# EAGLE design light sensor microshield v3 (EAGLE 6.4)
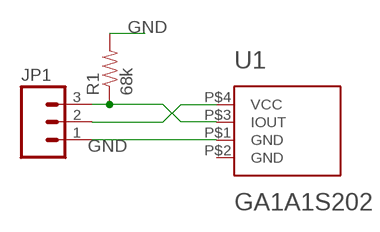
[diagram p0: schematic, sheet 1]

## Parts
JP1  M03PTH  [1X03]
R1  68k  RESISTOR0603-RES  [0603-RES]
U1  GA1A1S202  [GA1A12S202]

## Nets
GND: JP1.1 R1.2 U1.P$1(GND)
N$2: JP1.2 U1.P$4(VCC)
N$3: JP1.3 R1.1 U1.P$3(IOUT)

## Power pins joined to a net without a drawn wire
GND: U1.P$2(GND)

## Library data of the parts
JP1 = SparkFun-Connectors:M03: Header 3 Standard 3-pin 0.1" header. Use with straight break away headers (SKU : PRT-00116), right angle break away headers (PRT-00553), swiss pins (PRT-00743), machine pins (PRT-00117), and female headers (PRT-00115). Molex polarized connector foot print use with SKU : PRT-08232 with associated crimp pins and housings.
R1 = my library:RESISTOR: Resistor Basic schematic elements and footprints for 0603, 1206, and PTH resistors.
U1 = my library:GA1A1S202: GA1A1S202WP - Analog Light Sensor Technical Specifications: VCC: 2.3-3.2V Operating Temperature: -40°C to 85°C Dynamic Range: 3-55000 lux Peak Sensitivty: 555 nm Digikey: 425-2789-1-ND Mouser: 852-GA1A1S202WP

## Board
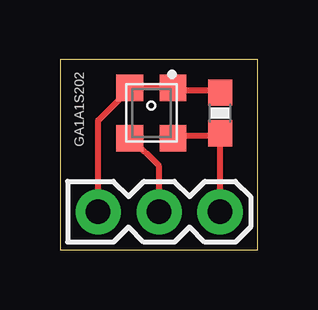
[diagram p1: board, top side]
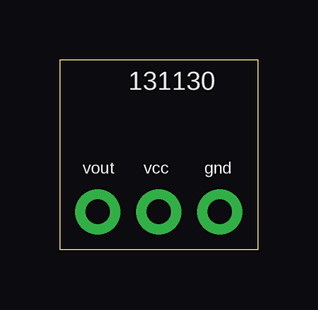
[diagram p2: board, bottom side, seen from below]

Size 8.24 x 7.93 mm. Coordinates in mm from the lower left corner, seen from the top.
Outline: 0,0 8.24,0 8.24,7.93 0,7.93 0,0
Copper layers (1*16): Top 0.0356mm / dielectric 1.5011mm / Bottom 0.0356mm
Design rules "LaenPCBOrder2 *": minimum track width 6mil, minimum drill 13mil, track to track 6mil, track to pad 6mil, pad to pad 6mil, via to via 6mil, smd to smd 6mil, copper to edge 15mil, drill to drill 6mil, minimum pad ring 7mil, minimum via ring 7mil, stop-mask expansion 4mil, vias tented up to drill 0mil, thermal gap 10mil

### Footprints (pad centres in the part's own frame; a part is rotated, then mirrored left to right if it is on the bottom)
1X03 = drill 1.016 pad 1.88: 1 0,0; 2 2.54,0; 3 5.08,0
0603-RES = smd 1.1 x 1: 1 -0.85,0; 2 0.85,0
GA1A12S202 = smd 1.108 x 1.108: P$1 -1.054,-0.904; P$2 -1.054,0.904; P$3 1.054,0.904; P$4 1.054,-0.904

### Placement (x,y rotation side)
JP1  1.59,1.59 0 top
R1  6.67,5.71 90 top
U1  3.81,5.71 270 top

### Tracks (layer width: path | path; a pad name or v marks a point on that pad's centre or on a via)
GND
  Top 0.254: R1.2 6.67,6.67 4.76,6.67 U1.P$2 4.64,6.79 2.98,6.79 U1.P$1 2.86,6.67 1.59,5.4 JP1.1
N$2
  Top 0.254: JP1.2 4.13,3.49 2.98,4.64 U1.P$4
N$3
  Top 0.254: 6.67,4.76 4.76,4.76 U1.P$3 | JP1.3 6.67,4.76 | 6.67,4.76 R1.1

### Text on the board
bPlace: 131130 | gnd | vcc | vout